# Altium project RPI_Pico.PrjPcb
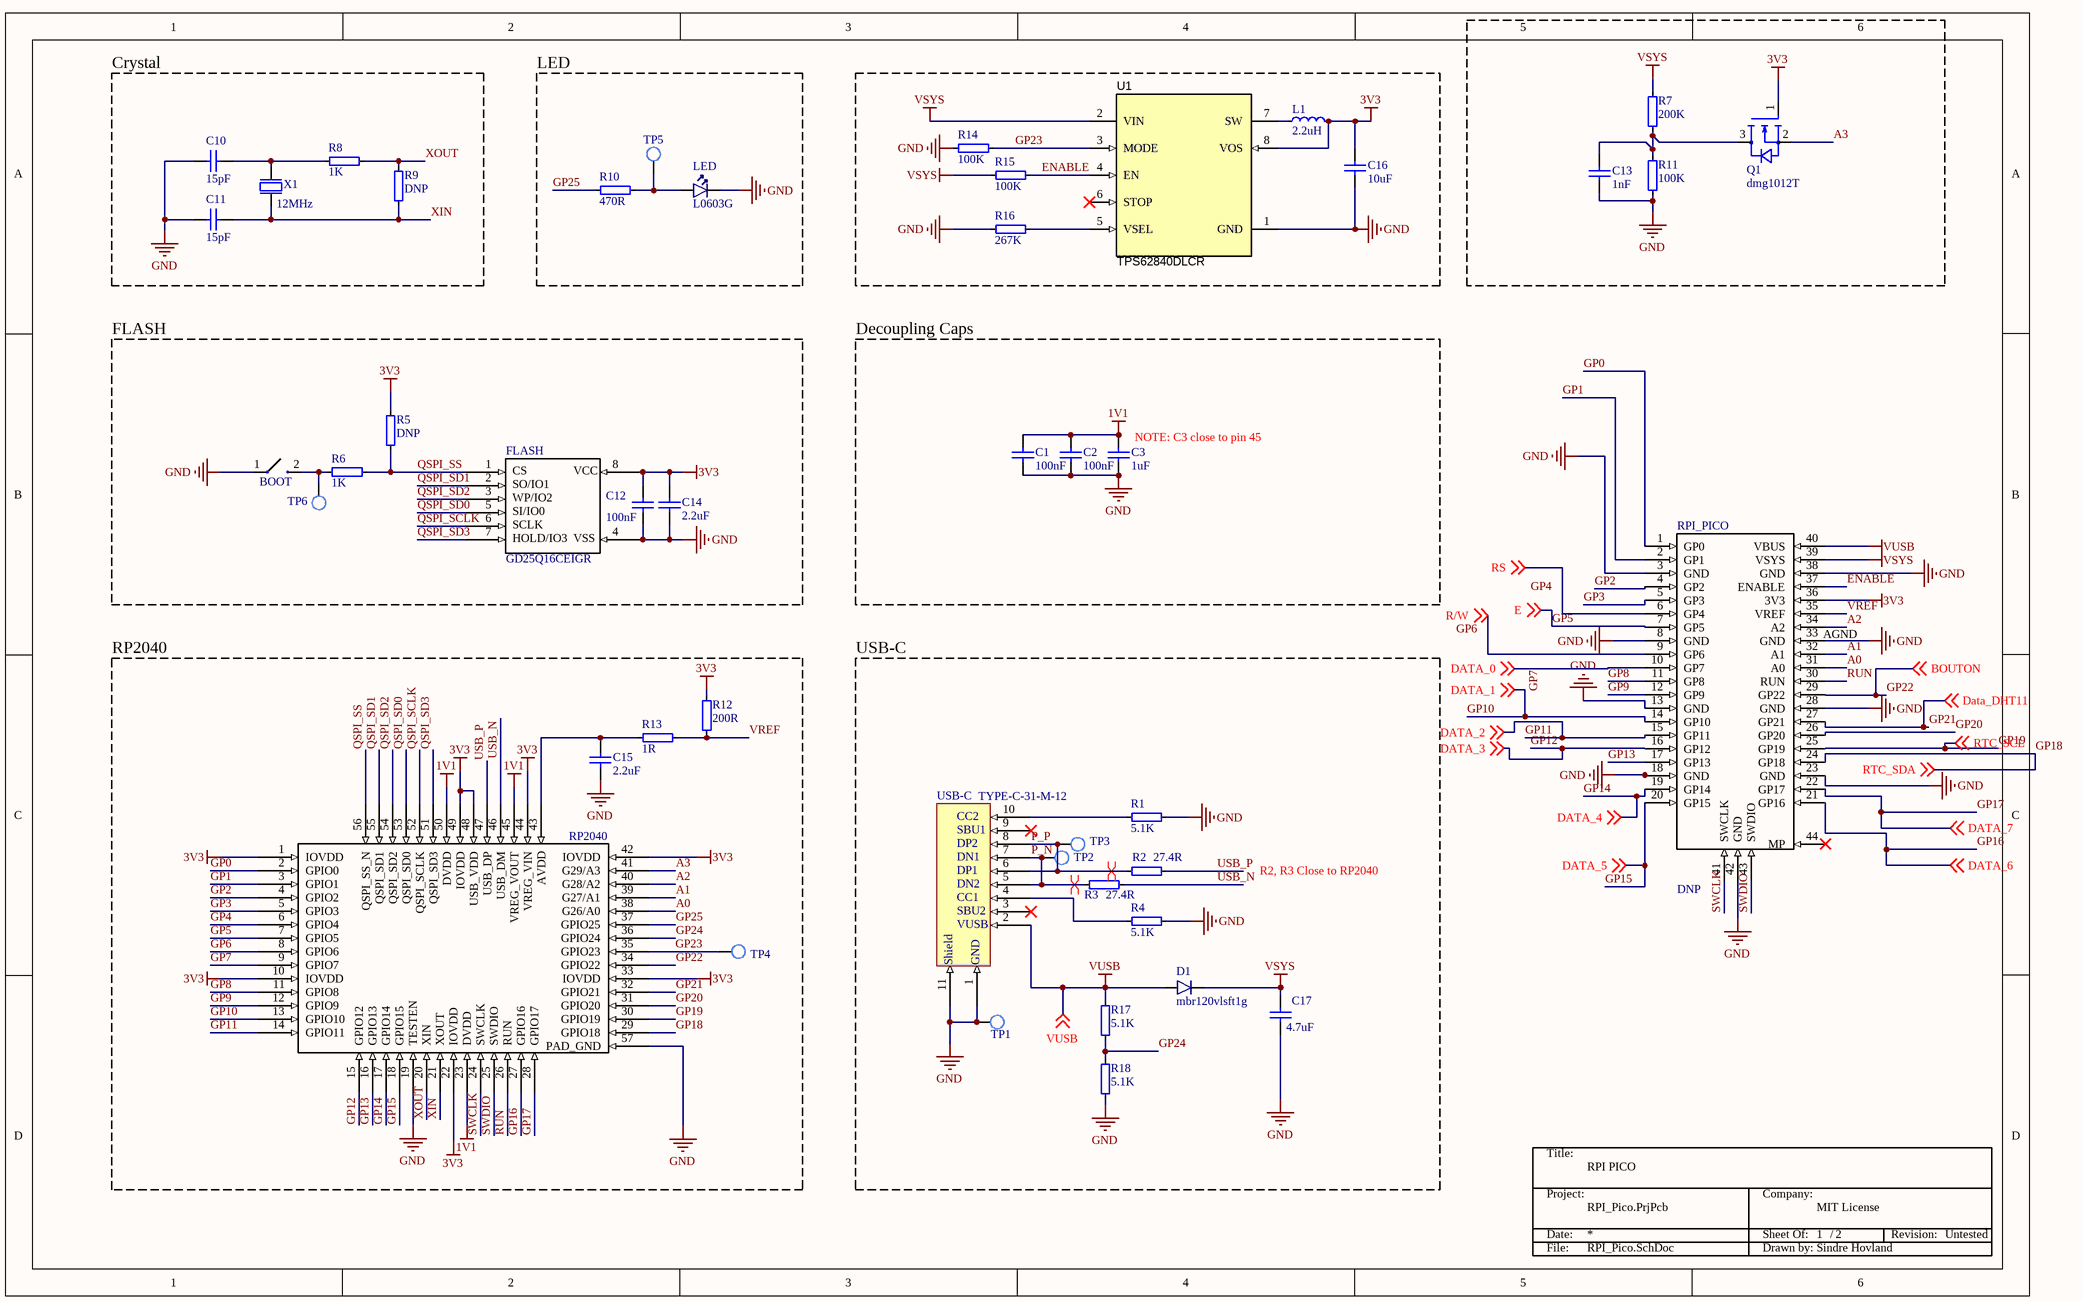
[diagram p0: RPI_Pico.SchDoc]
2 sheets, 54 parts. Net scope: global (net labels, ports and power ports of the same name join across sheets).
Board file: Pico.PcbDoc
Sheets:
  RPI_Pico.SchDoc
  Components_wheatherlab.SchDoc

## Sheet RPI_Pico.SchDoc: RPI PICO
size B; DrawnBy: Sindre Hovland; Organization: MIT License; Revision: Untested; SheetNumber: 1; SheetTotal: 2

### Parts
*  TitleBlock  (value not drawn)  (graphical)
BOOT  EVP-AA002K  [MiniSwitch]  (value not drawn)
C1  100nF  [C0402]
C2  100nF  [C0402]
C3  1uF  [C0402]
C10  15pF  [C0402]
C11  15pF  [C0402]
C12  100nF  [C0402]
C13  1nF  [C0402]
C14  2.2uF  [C0603]
C15  2.2uF  [C0603]
C16  10uF  [C0603]
C17  4.7uF  [C0603]
D1  mbr120vlsft1g  [SOD-123]
FLASH  GD25Q16CEIGR  [GD25Q16CEIGR]
L1  2.2uH  [IND0805]
LED  L0603G  [LED_0603]
Q1  dmg1012T  [SOTFL3P40_120X120X55L30X32N]
R1  5.1K  [RES0402]
R2  27.4R  [RES0402]
R3  27.4R  [RES0402]
R4  5.1K  [RES0402]
R5  DNP  [RES0402]
R6  1K  [RES0402]
R7  200K  [RES0402]
R8  1K  [RES0402]
R9  DNP  [RES0402]
R10  470R  [RES0603R]
R11  100K  [RES0402]
R12  200R  [RES0402]
R13  1R  [RES0402]
R14  100K  [RES0402]
R15  100K  [RES0402]
R16  267K  [RES0402]
R17  5.1K  [RES0402]
R18  5.1K  [RES0402]
RP2040  RP2040  [RP2040]  (value not drawn)
RPI_PICO  DNP  [RPI PICO]
TP1  DNP  [TP_SMD_1.0mm]  (value not drawn)
TP2  DNP  [TP_SMD_1.0mm]  (value not drawn)
TP3  DNP  [TP_SMD_1.0mm]  (value not drawn)
TP4  DNP  [TP_SMD_1.0mm]  (value not drawn)
TP5  DNP  [TP_SMD_1.0mm]  (value not drawn)
TP6  DNP  [TP_SMD_1.0mm]  (value not drawn)
U1  TPS62840DLCR  [TPS62840]
USB-C  TYPE-C-31-M-12  [TYPE-C-31-M-12]
X1  12MHz  [XTAL_2016]

### Blocks framed on the sheet
Crystal: C10 C11 R8 R9 X1
LED: LED R10 TP5
FLASH: BOOT C12 C14 FLASH R5 R6 TP6
Decoupling Caps: C1-C3
RP2040: C15 R12 R13 RP2040 TP4
USB-C: C17 D1 R1-R4 R17 R18 TP1-TP3 USB-C

### Nets
1V1: C1.2 C2.2 C3.2 RP2040.23(DVDD) RP2040.45(VREG_VOUT) RP2040.50(DVDD)
3V3: C12.2 C14.2 C16.2 FLASH.8 L1.2 Q1.1(G) R5.2 R12.2 RP2040.1(IOVDD) RP2040.10(IOVDD) RP2040.22(IOVDD) RP2040.33(IOVDD) RP2040.42(IOVDD) RP2040.44(VREG_VIN) RP2040.48(USB_VDD) RP2040.49(IOVDD) RPI_PICO.36(3V3) U1.8(VOS)
GND: BOOT.1 C1.1 C2.1 C3.1 C10.2 C11.2 C12.1 C13.1 C14.1 C15.1 C16.1 C17.1 FLASH.4 LED.1(C) R1.1 R4.2 R11.1 R14.2 R16.1 R18.1 RP2040.19(TESTEN) RP2040.57(PAD_GND) RPI_PICO.3(GND) RPI_PICO.8(GND) RPI_PICO.13(GND) RPI_PICO.18(GND) RPI_PICO.23(GND) RPI_PICO.28(GND) RPI_PICO.33(GND) RPI_PICO.38(GND) RPI_PICO.42(GND) TP1.1 U1.1(GND) USB-C.1 USB-C.11 X1.2(GND) X1.4(GND)
VSYS: C17.2 D1.2(C) R7.2 R15.2 RPI_PICO.39(VSYS) U1.2(VIN)
VUSB: D1.1(A) R17.2 RPI_PICO.40(VBUS) USB-C.2 ; off-sheet VUSB
A0: RP2040.38(G26/A0) RPI_PICO.31(A0)
A1: RP2040.39(G27/A1) RPI_PICO.32(A1)
A2: RP2040.40(G28/A2) RPI_PICO.34(A2)
A3: Q1.2(S) RP2040.41(G29/A3)
ENABLE: R15.1 RPI_PICO.37(ENABLE) U1.4(EN)
GP0: RP2040.2(GPIO0) RPI_PICO.1(GP0)
GP1: RP2040.3(GPIO1) RPI_PICO.2(GP1)
GP2: RP2040.4(GPIO2) RPI_PICO.4(GP2)
GP3: RP2040.5(GPIO3) RPI_PICO.5(GP3)
GP4: RP2040.6(GPIO4)
GP5: RP2040.7(GPIO5) RPI_PICO.7(GP5) ; off-sheet E  [also labelled E]
GP6: RP2040.8(GPIO6)
GP7: RP2040.9(GPIO7) RPI_PICO.10(GP7) ; off-sheet DATA_0  [also labelled DATA_0]
GP8: RP2040.11(GPIO8) RPI_PICO.11(GP8)
GP9: RP2040.12(GPIO9) RPI_PICO.12(GP9)
GP10: RP2040.13(GPIO10) RPI_PICO.14(GP10) ; off-sheet DATA_1  [also labelled DATA_1]
GP11: RP2040.14(GPIO11) RPI_PICO.15(GP11) ; off-sheet DATA_2  [also labelled DATA_2]
GP12: RP2040.15(GPIO12) RPI_PICO.16(GP12) ; off-sheet DATA_3  [also labelled DATA_3]
GP13: RP2040.16(GPIO13) RPI_PICO.17(GP13)
GP14: RP2040.17(GPIO14) RPI_PICO.19(GP14) ; off-sheet DATA_4  [also labelled DATA_4]
GP15: RP2040.18(GPIO15) RPI_PICO.20(GP15) ; off-sheet DATA_5  [also labelled DATA_5]
GP16: RP2040.27(GPIO16) RPI_PICO.21(GP16) ; off-sheet DATA_6  [also labelled DATA_6]
GP17: RP2040.28(GPIO17) RPI_PICO.22(GP17) ; off-sheet DATA_7  [also labelled DATA_7]
GP18: RP2040.29(GPIO18) RPI_PICO.24(GP18) ; off-sheet RTC_SDA  [also labelled RTC_SDA]
GP19: RP2040.30(GPIO19) RPI_PICO.25(GP19) ; off-sheet RTC_SCL  [also labelled RTC_SCL]
GP20: RP2040.31(GPIO20) RPI_PICO.26(GP20)
GP21: RP2040.32(GPIO21) RPI_PICO.27(GP21) ; off-sheet Data_DHT11  [also labelled Data_DHT11]
GP22: RP2040.34(GPIO22) RPI_PICO.29(GP22) ; off-sheet BOUTON  [also labelled BOUTON]
GP23: R14.1 RP2040.35(GPIO23) TP4.1 U1.3(MODE)
GP24: R17.1 R18.2 RP2040.36(GPIO24)
GP25: R10.1 RP2040.37(GPIO25)
P_N: R3.2 TP2.1 USB-C.5 USB-C.7
P_P: R2.2 TP3.1 USB-C.6 USB-C.8
QSPI_SCLK: FLASH.6 RP2040.52(QSPI_SCLK)
QSPI_SD0: FLASH.5 RP2040.53(QSPI_SD0)
QSPI_SD1: FLASH.2 RP2040.55(QSPI_SD1)
QSPI_SD2: FLASH.3 RP2040.54(QSPI_SD2)
QSPI_SD3: FLASH.7 RP2040.51(QSPI_SD3)
QSPI_SS: FLASH.1 R5.1 R6.2 RP2040.56(QSPI_SS_N)
R/W: RPI_PICO.9(GP6) ; off-sheet R/W
RS: RPI_PICO.6(GP4) ; off-sheet RS
RUN: RP2040.26(RUN) RPI_PICO.30(RUN)
SWCLK: RP2040.24(SWCLK) RPI_PICO.41(SWCLK)
SWDIO: RP2040.25(SWDIO) RPI_PICO.43(SWDIO)
USB_N: R3.1 RP2040.46(USB_DM)
USB_P: R2.1 RP2040.47(USB_DP)
VREF: R12.1 R13.1 RPI_PICO.35(VREF)
XIN: C11.1 R9.1 RP2040.21(XOUT) X1.1(inp)
XOUT: R8.2 R9.2 RP2040.20(XIN)
NetBOOT_2: BOOT.2 R6.1 TP6.1
NetC10_1: C10.1 R8.1 X1.3(out)
NetC13_2: C13.2 Q1.3(D) R7.1 R11.2
NetC15_2: C15.2 R13.2 RP2040.43(AVDD)
NetL1_1: L1.1 U1.7(SW)
NetLED_2: LED.2(A) R10.2 TP5.1
NetR1_2: R1.2 USB-C.10
NetR4_1: R4.1 USB-C.4
NetR16_2: R16.2 U1.5(VSEL)

Not connected (* = marked no-connect by the designer): RPI_PICO 44(MP)*; U1 6(STOP)*; USB-C 3* 9*

### Layout directives
differential pair: P_N, P_P

### Notes on the sheet
- (near C3) NOTE: C3 close to pin 45
- (near RPI_PICO) AGND
- R2, R3 Close to RP2040
- Labels drawn without touching a wire or pin: GP4, GP6
- (in symbol Flash SPI) CS; VCC; SO/IO1; WP/IO2; SI/IO0; SCLK; HOLD/IO3; VSS
- (in symbol TitleBlock) Title:; Project:; Company:; Date:; Sheet Of:; /; Revision:; File:; Drawn by:
- (in symbol USB-C) CC2; SBU1; DP2; DN1; DP1; DN2; CC1; SBU2; VUSB; Shield; GND

### Library data of the parts
BOOT = SwitchMini: EVPAA002K = 1.0 N, EVPAAU02Q = 7.0 N; Supplier 1: Digi-Key; Supplier Part Number 1: P13347SCT-ND
C1-C3 C10-C17 = CAP: Capacitor; Value: 100pF; Published: 8-Jun-2000; Revision: July-2002: Re-released for DXP Platform.; Publisher: Altium Limited
D1 = Diode: Switch-mode Schottky / Power Rectifier / 250 V, 40 A
FLASH = Flash SPI: Flash SPI 16Mb = 2 MB; Supplier 1: Mouser; Supplier Part Number 1: 363-GD25Q16CEIGR
L1 = IND: Inductor; Part Number: FB0402-120R@100M-500mA; Manufacturer: Murata; Manufacturer Part Number: BLM15AG121SN1D; Part number IPS: N.A.; Value: 120R/0.55A; Note: Chip EMIFIL Inductor Type Chip Ferrite Bead; Artikkelnr Noca: 33029317; Footprint Doc: 0402; LatestRevisionDate: 2014-01-10; Pin Count: 2; Publisher: Nordic Semiconductor; Published: 2011-11-14; ComponentLink1URL: *; ComponentLink1Description: Datasheet; ComponentLink2URL: *; ComponentLink2Description: Supplier link; HelpURL: http://search.murata.co.jp/Ceramy/image/img/PDF/ENG/L0110S0100BLM15A_SN.pdf
LED = D:LED: LED, Green, 0603, 570nm, Vf=1.7V, 2.24..5.6mcd, - 40 to +100°C; Part Number: LG L29K Smartled Green; Manufacturer: Osram; Manufacturer Part Number: LG L29K-G2J1-24-Z; Part number IPS: N.A.; Note: 2.24..5.6 mcd, Vfmin=1.7V; Artikkelnr Noca: 13019147; Footprint Doc: 0603; LatestRevisionDate: 2017-08-21; Pin Count: 2; Publisher: Nordic Semiconductor; Published: 2014-10-28; Value: L0603G; ComponentLink1URL: *; ComponentLink1Description: Datasheet; ComponentLink2URL: *; ComponentLink2Description: Supplier link; HelpURL: http://www.osram-os.com/Graphics/XPic2/00077107_0.pdf; Supplier 1: Digi-Key; Supplier Part Number 1: 475-2709-1-ND; Supplier 2: Mouser; Supplier Part Number 2: 720-LGL29KG2J124Z
Q1 = Transistor: N-Channel 20V 100mA _Ta_ 150mW _Ta_ Surface Mount VMT3; MF: Rohm; MP: RUM001L02T2CL; Value: *; SnapEDA_Link: https://www.snapeda.com/parts/RUM001L02T2CL/Rohm/view-part/531428/?ref=snap; Digi-Key_Part_Number: RUM001L02T2CLCT-ND; Digi-Key_Purchase_URL: https://www.digikey.com/product-detail/en/rohm-semiconductor/RUM001L02T2CL/RUM001L02T2CLCT-ND/4571412?utm_source=snapeda&utm_medium=aggregator&utm_campaign=symbol; Package: SOT-723 Rohm
R1-R18 = RES: Resistor, ±5%, 0.05W; Part Number: R0201-0R; Part number IPS: 00000003245; Value: 0R; Note: Chip Res 5%; Artikkelnr Noca: N.A.; Manufacturer: *; Manufacturer Part Number: *; ComponentLink1URL: *; ComponentLink1Description: Datasheet; ComponentLink2URL: *; ComponentLink2Description: Supplier link; HelpURL: *; Footprint Doc: 0201; LatestRevisionDate: 2017-11-09; Pin Count: 2; Publisher: Nordic Semiconductor; Published: 2014-11-13; Supplier 1: *; Supplier Part Number 1: *; Supplier 2: *; Supplier Part Number 2: *
RP2040 = RP2040: RP2040 First MCU from RPI
RPI_PICO = RPI_PICO
TP1-TP6 = TP
U1 = TPS62840: Ultra low IQ Step Down Converter, DLC0008A (VSON-HR-8); Alternate Manufacturer: Texas Instruments; SizeAreaWB_mm2: 7.5; SizeZ_mm: 1; SizeX_mm: 1.5; SizeY_mm: 2; SizeArea_mm2: 3; CompType: IC; AEC Qualified: N; AEC Category: Q200; ComponentLink1URL: http://www.ti.com/lit/ds/symlink/tps62840.pdf; PackageDescription: VSON-HR-8; MountType: SMT; ComponentLink2URL: http://www.ti.com/product/tps62840; ComponentLink3Description: Online Datasheet; ComponentLink2Description: Product Folder; Manufacturer: Texas Instruments; ComponentLink3URL: http://www.ti.com/product/tps62840/datasheet; PackageReference: DLC0008A; ComponentLink1Description: Datasheet Link; Operating Temperature Range: -40 to 125 C; Supplier 1: Mouser; Supplier Part Number 1: 595-TPS62840DLCR; PartNumber: TPS62840DLCR
USB-C = USB-C: USB C connector; ComponentLink1Description: LCSC; ComponentLink1URL: https://lcsc.com/product-detail/USB-Connectors_Korean-Hroparts-Elec-TYPE-C-31-M-12_C165948.html
X1 = XTAL_SMD2016: XTAL SMD 2016, 32MHz, Cl=8pF, Total Tol: ±40ppm; Part Number: XTAL_SMD2016_32MHz_8pF_General; LatestRevisionDate: 2016-08-19; Pin Count: 4; Publisher: Nordic Semiconductor; Published: 2016-08-19; Value: 32MHz; Footprint Doc: XTAL_2016; Manufacturer: *; Manufacturer Part Number: *

## Sheet Components_wheatherlab.SchDoc
size A2; SheetNumber: 2; SheetTotal: 2
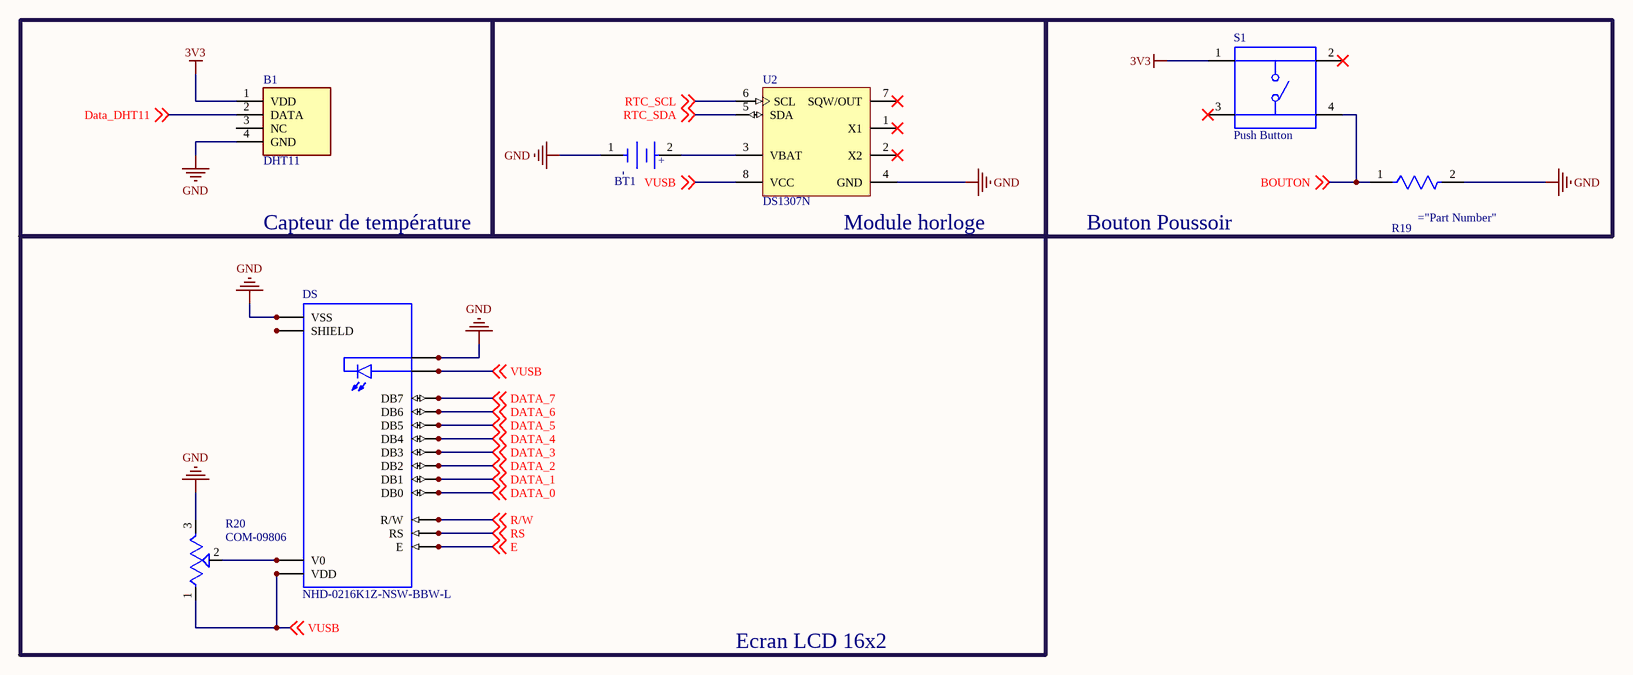
[diagram p1: Components_wheatherlab.SchDoc]

### Parts
B1  DHT11  [386]
BT1  3034TR  [Keystone_0_MFG]  (value not drawn)
DS  NHD-0216K1Z-NSW-BBW-L  [NHD_NHD-0216K1Z-NSW-BBW-L]
R19  10kohm  [Stackpole_RMCF0603_IPC_A]  (value not drawn)
R20  COM-09806  [TRIM_COM-09806]
S1  Push Button  [SW_TS02-66-50-BK-160-LCR-D]
U2  DS1307N  [P8-2]

### Blocks framed on the sheet
Capteur de température: B1
Module horloge: BT1 U2
Bouton Poussoir: R19 S1
Ecran LCD 16x2: DS R20

### Nets
3V3: B1.1(VDD) S1.1
GND: B1.4(GND) BT1.1(C) DS.1_1(VSS) DS.1_2(VSS) DS.16_1(LED-) DS.16_2(LED-) R19.2 R20.3(CW) U2.4(GND)
VUSB: DS.2_1(VDD) DS.2_2(VDD) DS.15_1(LED+) DS.15_2(LED+) R20.1(CCW) U2.8(VCC) ; off-sheet VUSB
BOUTON: R19.1 S1.4 ; off-sheet BOUTON  [project net GP22]
DATA_0: DS.7_1(DB0) DS.7_2(DB0) ; off-sheet DATA_0  [project net GP7]
DATA_1: DS.8_1(DB1) DS.8_2(DB1) ; off-sheet DATA_1  [project net GP10]
DATA_2: DS.9_1(DB2) DS.9_2(DB2) ; off-sheet DATA_2  [project net GP11]
DATA_3: DS.10_1(DB3) DS.10_2(DB3) ; off-sheet DATA_3  [project net GP12]
DATA_4: DS.11_1(DB4) DS.11_2(DB4) ; off-sheet DATA_4  [project net GP14]
DATA_5: DS.12_1(DB5) DS.12_2(DB5) ; off-sheet DATA_5  [project net GP15]
DATA_6: DS.13_1(DB6) DS.13_2(DB6) ; off-sheet DATA_6  [project net GP16]
DATA_7: DS.14_1(DB7) DS.14_2(DB7) ; off-sheet DATA_7  [project net GP17]
Data_DHT11: B1.2(DATA) ; off-sheet Data_DHT11  [project net GP21]
E: DS.6_1(E) DS.6_2(E) ; off-sheet E  [project net GP5]
R/W: DS.5_1(R/W) DS.5_2(R/W) ; off-sheet R/W
RS: DS.4_1(RS) DS.4_2(RS) ; off-sheet RS
RTC_SCL: U2.6(SCL) ; off-sheet RTC_SCL  [project net GP19]
RTC_SDA: U2.5(SDA) ; off-sheet RTC_SDA  [project net GP18]
NetBT1_2: BT1.2(A) U2.3(VBAT)
NetDS_3_1: DS.3_1(V0) DS.3_2(V0) R20.2(WIPER)
NetDS_S1: DS.S1(SHIELD) DS.S2(SHIELD) DS.S3(SHIELD) DS.S4(SHIELD)

Not connected (* = marked no-connect by the designer): B1 3(NC); S1 2* 3*; U2 1(X1)* 2(X2)* 7(SQW/OUT)*

### Notes on the sheet
- (in symbol 3034TR) +; -

### Library data of the parts
B1 = 386: Adafruit Accessories DHT11 Basic Temp Humidity Sensor; Geometry.Height: 15.5mm; Manufacturer_Name: Adafruit; Manufacturer_Part_Number: 386; Mouser Part Number: 485-386; Mouser Price/Stock: https://www.mouser.co.uk/ProductDetail/Adafruit/386?qs=GURawfaeGuDbeGFpZ2393w%3D%3D; Arrow Part Number: 386; Arrow Price/Stock: https://www.arrow.com/en/products/386/adafruit-industries?region=nac; Datasheet Link: https://datasheet.datasheetarchive.com/originals/distributors/DKDS-1/1982.pdf
DS = NHD-0216K1Z-NSW-BBW-L: Character LCD Display Module Transmissive 5 x 8 Dots STN - Super-Twisted Nematic LED - White Parallel 80.00mm x 36.00mm x 13.50mm; MF: Newhaven Display; Package: None; MP: NHD-0216K1Z-NSW-BBW-L; DigiKey-Purchase-URL: https://snapeda.com/shop?store=DigiKey&id=55814; Digi-Key_Part_Number: NHD-0216K1Z-NSW-BBW-L-ND; Value: *; SnapEDA_Link: https://www.snapeda.com/parts/NHD-0216K1Z-NSW-BBW-L/Newhaven%20Display%20Intl/view-part/55814/?ref=snap
R19 = RMCF0603FT220R
R20 = COM-09806: 10 kOhms 0.5W, 1/2W PC Pins Through Hole Trimmer Potentiometer Cermet 1 Turn Top Adjustment; Package: None; Price: None; Value: *; MP: COM-09806; Availability: Unavailable
S1 = TS02-66-50-BK-160-LCR-D: MF: {'manufacturer': u'CUI'}; Package: None; Availability: Unavailable; Value: *; MP: TS02-66-50-BK-160-LCR-D; Price: None
U2 = DS1307N: 64 x 8, Serial, I2C Real-Time Clock, 5.0V, 8-Pin PDIP, -40 to 85 degC; ComponentLink1Description: Manufacturer URL; ComponentLink2Description: Datasheet; DatasheetVersion: 10-Feb-2008; ComponentLink3URL: http://pdfserv.maxim-ic.com/package_dwgs/21-0043.PDF; ComponentLink3Description: Package Specification; ComponentLink1URL: http://www.maxim-ic.com; Code_JEDEC: MS-001-AB; PackageVersion: revE, 2011; PackageDescription: 8-Pin Plastic Dual-In-Line, Narrow (0.3in), Pitch 2.54 mm, PDIP(N); ComponentLink2URL: http://datasheets.maxim-ic.com/en/ds/DS1307.pdf; PackageReference: P8-2; PartNumber: DS1307N

## Nets that join several sheets
3V3: RPI_Pico (18 pins), Components_wheatherlab (B1.1 S1.1)
GND: RPI_Pico (37 pins), Components_wheatherlab (9 pins)
VUSB: RPI_Pico (D1.1 R17.2 RPI_PICO.40 USB-C.2), Components_wheatherlab (6 pins)
GP5: RPI_Pico (RP2040.7 RPI_PICO.7), Components_wheatherlab (DS.6_1 DS.6_2)
GP7: RPI_Pico (RP2040.9 RPI_PICO.10), Components_wheatherlab (DS.7_1 DS.7_2)
GP10: RPI_Pico (RP2040.13 RPI_PICO.14), Components_wheatherlab (DS.8_1 DS.8_2)
GP11: RPI_Pico (RP2040.14 RPI_PICO.15), Components_wheatherlab (DS.9_1 DS.9_2)
GP12: RPI_Pico (RP2040.15 RPI_PICO.16), Components_wheatherlab (DS.10_1 DS.10_2)
GP14: RPI_Pico (RP2040.17 RPI_PICO.19), Components_wheatherlab (DS.11_1 DS.11_2)
GP15: RPI_Pico (RP2040.18 RPI_PICO.20), Components_wheatherlab (DS.12_1 DS.12_2)
GP16: RPI_Pico (RP2040.27 RPI_PICO.21), Components_wheatherlab (DS.13_1 DS.13_2)
GP17: RPI_Pico (RP2040.28 RPI_PICO.22), Components_wheatherlab (DS.14_1 DS.14_2)
GP18: RPI_Pico (RP2040.29 RPI_PICO.24), Components_wheatherlab (U2.5)
GP19: RPI_Pico (RP2040.30 RPI_PICO.25), Components_wheatherlab (U2.6)
GP21: RPI_Pico (RP2040.32 RPI_PICO.27), Components_wheatherlab (B1.2)
GP22: RPI_Pico (RP2040.34 RPI_PICO.29), Components_wheatherlab (R19.1 S1.4)
R/W: RPI_Pico (RPI_PICO.9), Components_wheatherlab (DS.5_1 DS.5_2)
RS: RPI_Pico (RPI_PICO.6), Components_wheatherlab (DS.4_1 DS.4_2)

## Assembly variants
Default: not fitted R5 R9 RPI_PICO TP1 TP2 TP3 TP4 TP5 TP6